# EAGLE design RainMeterRAK (EAGLE 9.6.2)
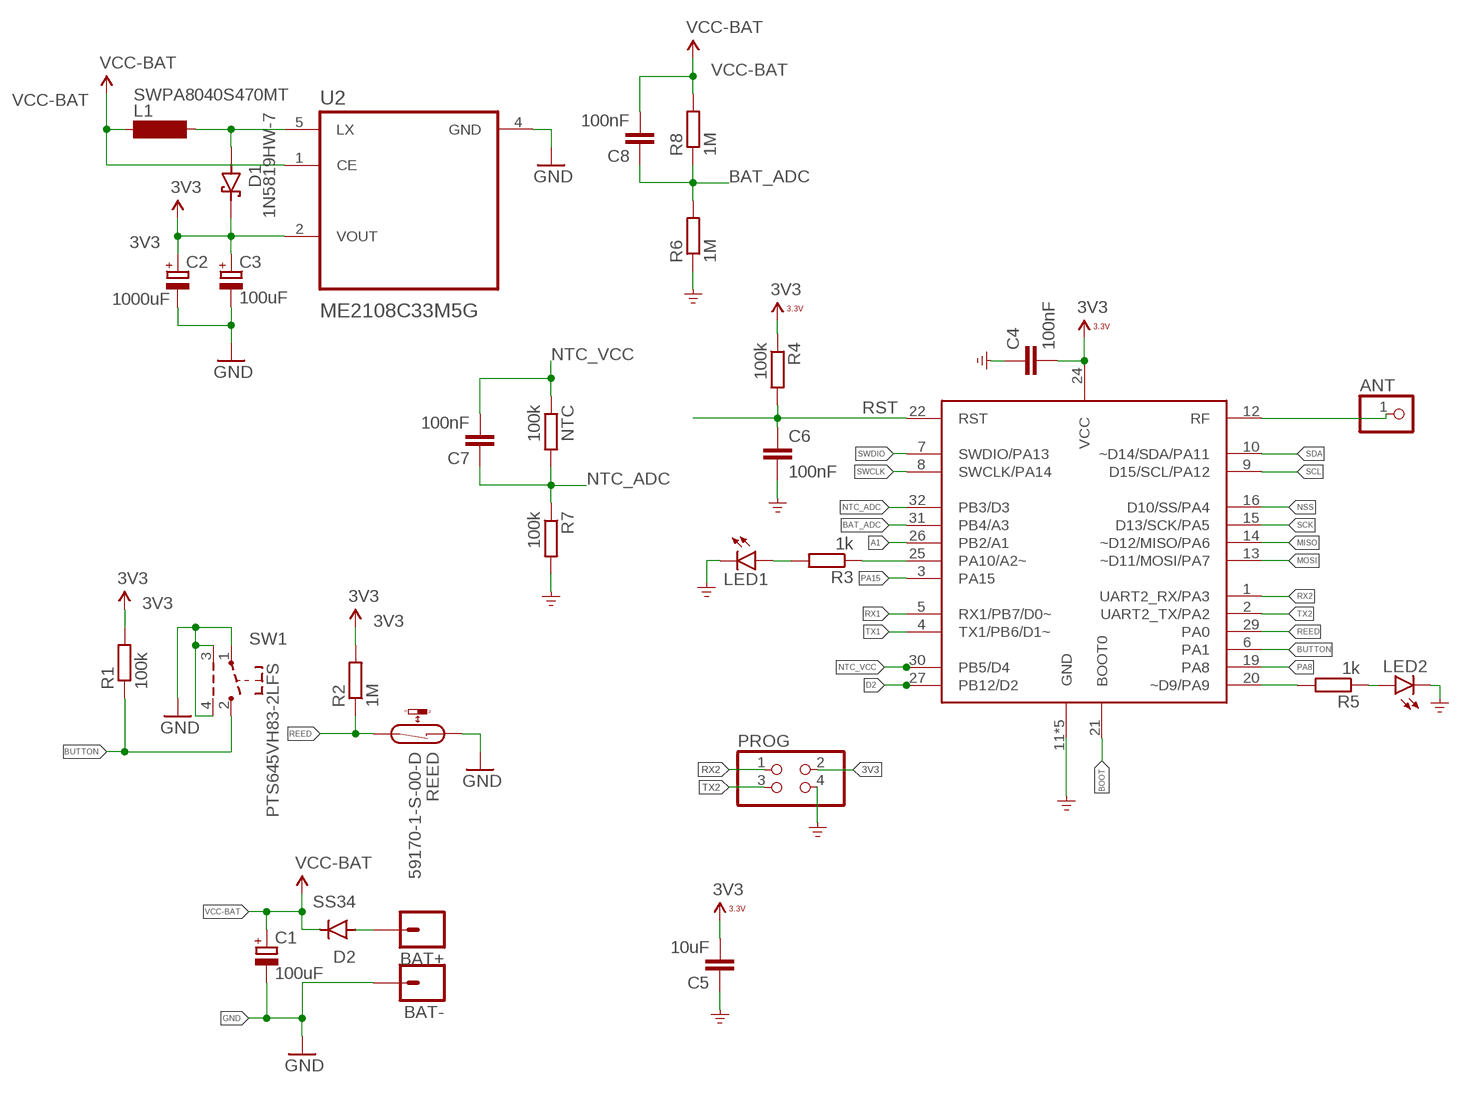
[diagram p0: schematic, sheet 1]

## Parts
ANT  PINHD-1X1  [1X01]
BAT+  M01OFFSET  [1X01_OFFSET]
BAT-  M01OFFSET  [1X01_OFFSET]
C1  100uF  CPOL-EUCT3528  [CT3528]
C2  1000uF  CPOL-EU140CLH-0810  [140CLH-0810]
C3  100uF  CPOL-EUCT3528  [CT3528]
C4  100nF  C-EUC0603  [C0603]
C5  10uF  C-EUC0603  [C0603]
C6  100nF  C-EUC0603  [C0603]
C7  100nF  C-EUC0603  [C0603]
C8  100nF  C-EUC0603  [C0603]
D1  1N5819HW-7  [SOD3715X145N]
D2  SS34  CGRM4001-G  [SOD-123_MINI-SMA]
L1  SWPA8040S470MT  SWPA8040S  [SWPA8040S]
LED1  LEDCHIP-LED0603  [CHIP-LED0603]
LED2  LEDCHIP-LED0603  [CHIP-LED0603]
NTC  100k  R-EU_R0603  [R0603]
PROG  PINHD-2X2  [2X02]
R1  100k  R-EU_R0603  [R0603]
R2  1M  R-EU_R0603  [R0603]
R3  1k  R-EU_R0603  [R0603]
R4  100k  R-EU_R0603  [R0603]
R5  1k  R-EU_R0603  [R0603]
R6  1M  R-EU_R0603  [R0603]
R7  100k  R-EU_R0603  [R0603]
R8  1M  R-EU_R0603  [R0603]
REED  59170-1-S-00-D  REED-SWITCH-CT10-1530-G1  [CT10-G1]
SW1  PTS645VH83-2LFS  SW_TACT_4P_B  [SW_TACT_STANDARD_RIGHT_ANGLE]
U1  RAK3172HF  [RAK3172]
U2  ME2108C33M5G  [SOT23-5]

## Nets
3V3: C2.+ C3.+ C4.2 C5.2 D1.C(K) PROG.2 R1.2 R2.2 R4.1 U1.24(VCC) U2.2(VOUT)
A1: U1.26(PB2/A1)
BAT_ADC: C8.1 R6.2 R8.1 U1.31(PB4/A3)
BOOT: U1.21(BOOT0)
BUTTON: R1.1 SW1.2 U1.6(PA1)
D2: U1.27(PB12/D2)
GND: BAT-.1 C1.- C2.- C3.- C4.1 C5.1 C6.2 LED1.C LED2.C PROG.4 R6.1 R7.2 REED.1 SW1.1 SW1.3 SW1.4 U1.11(GND) U1.17(GND) U1.18(GND) U1.23(GND) U1.28(GND) U2.4(GND) ; supply symbol labelled GND_POWER
MISO: U1.14(~D12/MISO/PA6)
MOSI: U1.13(~D11/MOSI/PA7)
N$1: D1.A L1.2 U2.5(LX)
N$2: R5.2 U1.20(~D9/PA9)
N$3: LED2.A R5.1
N$4: R3.1 U1.25(PA10/A2~)
N$5: LED1.A R3.2
N$6: ANT.1 U1.12(RF)
N$7: BAT+.1 D2.A
NSS: U1.16(D10/SS/PA4)
NTC_ADC: C7.1 NTC.2 R7.1 U1.32(PB3/D3)
NTC_VCC: C7.2 NTC.1 U1.30(PB5/D4)
PA8: U1.19(PA8)
PA15: U1.3(PA15)
REED: R2.1 REED.2 U1.29(PA0)
RST: C6.1 R4.2 U1.22(RST)
RX1: U1.5(RX1/PB7/D0~)
RX2: PROG.1 U1.1(UART2_RX/PA3)
SCK: U1.15(D13/SCK/PA5)
SCL: U1.9(D15/SCL/PA12)
SDA: U1.10(~D14/SDA/PA11)
SWCLK: U1.8(SWCLK/PA14)
SWDIO: U1.7(SWDIO/PA13)
TX1: U1.4(TX1/PB6/D1~)
TX2: PROG.3 U1.2(UART2_TX/PA2)
VCC-BAT: C1.+ C8.2 D2.C L1.1 R8.2 U2.1(CE)

## Library data of the parts
ANT = pinhead:PINHD-1X1: PIN HEADER
BAT+ BAT- = SparkFun-Connectors:M01: Header 1 Standard 1-pin 0.1" header. Use with straight break away headers (SKU : PRT-00116), right angle break away headers (PRT-00553), swiss pins (PRT-00743), machine pins (PRT-00117), and female headers (PRT-00115).
C1-C3 = rcl:CPOL-EU: POLARIZED CAPACITOR, European symbol; SPICEPREFIX: C
C4-C8 = rcl:C-EU: CAPACITOR, European symbol; SPICEPREFIX: C
D1 = 1N5819HW-7:1N5819HW-7: 1N5819HW Series 40 V 1 A Surface Mount Schottky Barrier Rectifier - SOD-123 Check availability <https://pricing.snapeda.com/parts/1N5819HW-7/Diodes%20Inc./view-part?ref=eda>; AVAILABILITY: In Stock; DESCRIPTION: Diode Schottky 40 V 1A Surface Mount SOD-123; MF: Diodes Inc.; MP: 1N5819HW-7; PACKAGE: SOD-123 Fairchild Semiconductor; PRICE: None; PURCHASE-URL: https://pricing.snapeda.com/search/part/1N5819HW-7/?ref=eda
D2 = diode:CGRM400*-G: Molded plasitc,JEDEC SOD-123/Mini SMA Source: Comchip CGRM4001-G.pdf
L1 = SWPA8040S:SWPA8040S
LED1 LED2 = led:LED: LED OSRAM: - CHIPLED LG R971, LG N971, LY N971, LG Q971, LY Q971, LO R971, LY R971 LH N974, LH R974 LS Q976, LO Q976, LY Q976 LO Q996 - Hyper CHIPLED LW Q18S LB Q993, LB Q99A, LB R99A - SideLED LS A670, LO A670, LY A670, LG A670, LP A670 LB A673, LV A673, LT A673, LW A673 LH A674 LY A675 LS A676, LA A676, LO A676, LY A676, LW A676 LS A679, LY A679, LG A679 - Hyper Micro SIDELED® LS Y876, LA Y876, LO Y876, LY Y876 LT Y87S - SmartLED LW L88C, LW L88S LB L89C, LB L89S, LG L890 LS L89K, LO L89K, LY L89K LS L896, LA L896, LO L896, LY L896 - TOPLED LS T670, LO T670, LY T670, LG T670, LP T670 LSG T670, LSP T670, LSY T670, LOP T670, LYG T670 LG T671, LOG T671, LSG T671 LB T673, LV T673, LT T673, LW T673 LH T674 LS T676, LA T676, LO T676, LY T676, LB T676, LH T676, LSB T676, LW T676 LB T67C, LV T67C, LT T67C, LS T67K, LO T67K, LY T67K, LW E67C LS E67B, LA E67B, LO E67B, LY E67B, LB E67C, LV E67C, LT E67C LW T67C LS T679, LY T679, LG T679 LS T770, LO T770, LY T770, LG T770, LP T770 LB T773, LV T773, LT T773, LW T773 LH T774 LS E675, LA E675, LY E675, LS T675 LS T776, LA T776, LO T776, LY T776, LB T776 LHGB T686 LT T68C, LB T68C - Hyper Mini TOPLED® LB M676 - Mini TOPLED Santana® LG M470 LS M47K, LO M47K, LY M47K Source: http://www.osram.convergy.de LUXEON: - LUMILED® LXK2-PW12-R00, LXK2-PW12-S00, LXK2-PW14-U00, LXK2-PW14-V00 LXK2-PM12-R00, LXK2-PM12-S00, LXK2-PM14-U00 LXK2-PE12-Q00, LXK2-PE12-R00, LXK2-PE12-S00, LXK2-PE14-T00, LXK2-PE14-U00 LXK2-PB12-K00, LXK2-PB12-L00, LXK2-PB12-M00, LXK2-PB14-N00, LXK2-PB14-P00, LXK2-PB14-Q00 LXK2-PR12-L00, LXK2-PR12-M00, LXK2-PR14-Q00, LXK2-PR14-R00 LXK2-PD12-Q00, LXK2-PD12-R00, LXK2-PD12-S00 LXK2-PH12-R00, LXK2-PH12-S00 LXK2-PL12-P00, LXK2-PL12-Q00, LXK2-PL12-R00 Source: www.luxeon.com KINGBRIGHT: KA-3528ASYC Source: www.kingbright.com
NTC R1-R8 = rcl:R-EU_: RESISTOR, European symbol; SPICEPREFIX: R
PROG = pinhead:PINHD-2X2: PIN HEADER
REED = switch-reed:REED-SWITCH-: Reed Sensor; MF: COTO TECHNOLOGY; MPN: CT10-1530-G1; OC_FARNELL: 1081696
SW1 = dp_devices:SW_TACT_4P_B
U1 = RAK3172:RAK3172: RAK4260 LoRaWAN module from RAKwireless.
U2 = ME2108C33M5G:ME2108C33M5G: Check availability <https://pricing.snapeda.com/parts/TLV62568DBVR/Texas%20Instruments/view-part?ref=eda>; AVAILABILITY: In Stock; DESCRIPTION: 2.5V-5.5V input, 1A high efficiency step-down buck converter in SOT23 and SOT563 package; MF: Texas Instruments; MP: TLV62568DBVR; PACKAGE: SOT-23-5 Texas Instruments; PRICE: None; PURCHASE-URL: https://pricing.snapeda.com/search/part/TLV62568DBVR/?ref=eda

## Board
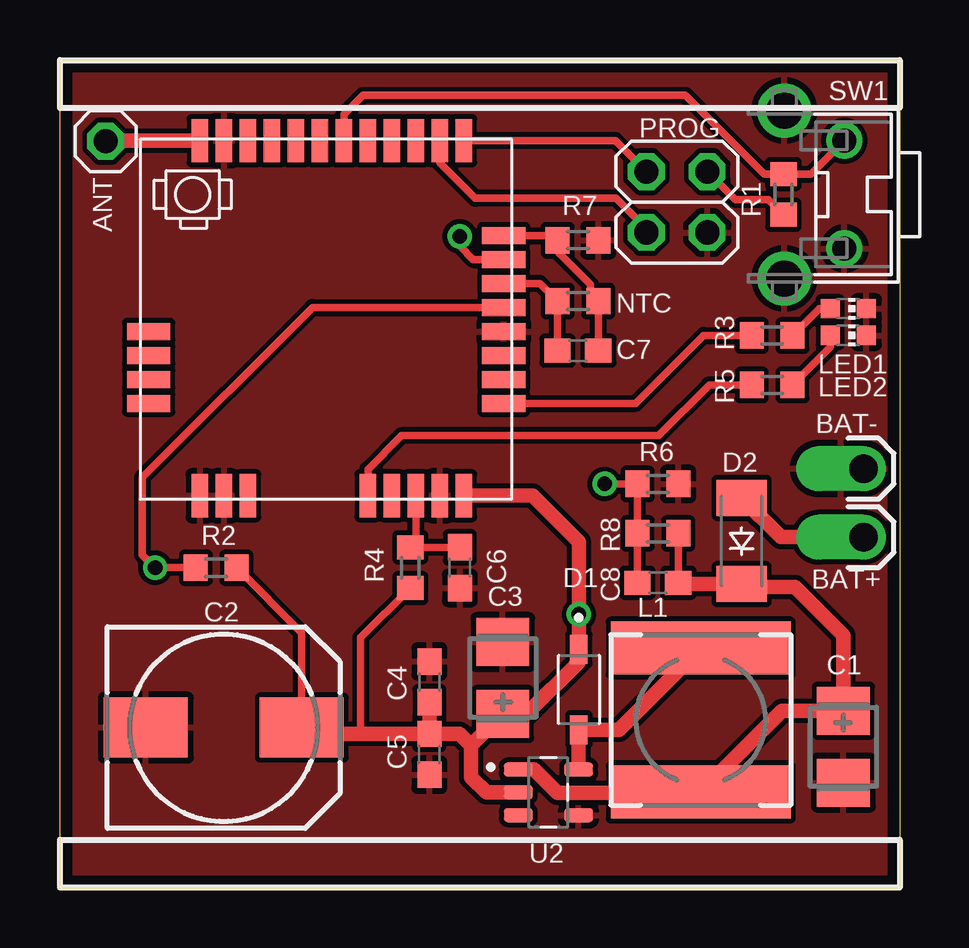
[diagram p1: board, top side]
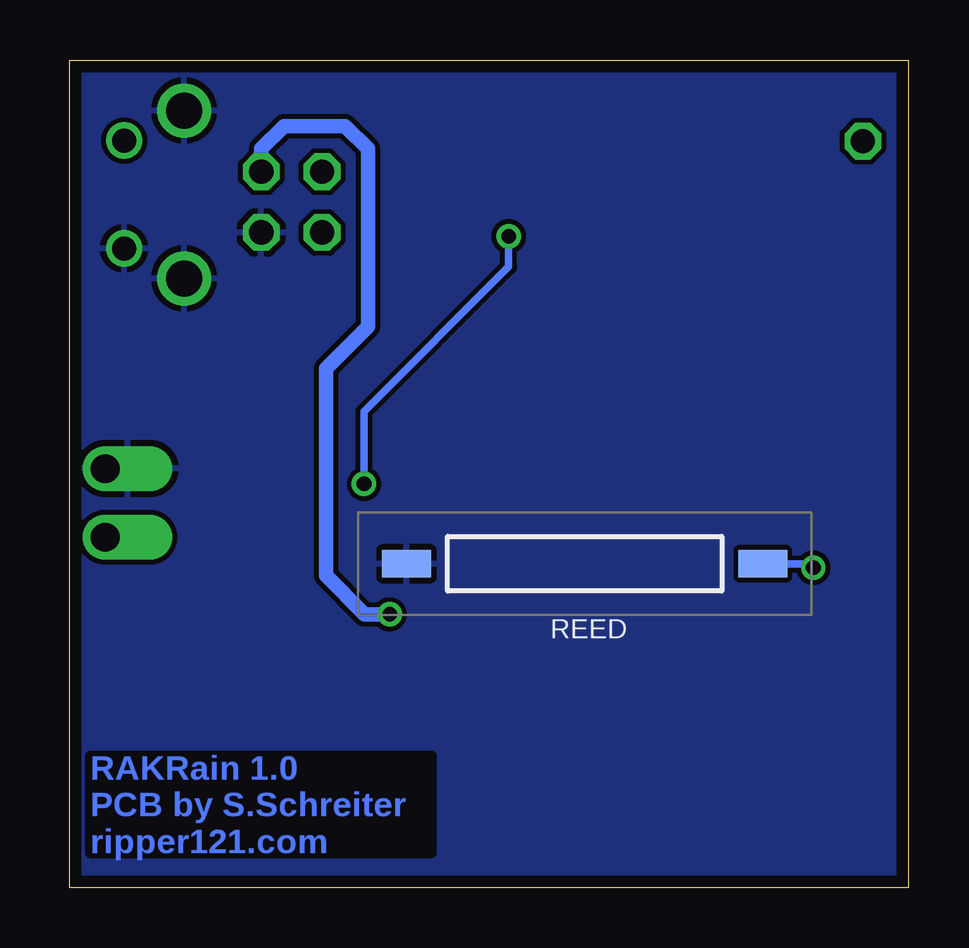
[diagram p2: board, bottom side, seen from below]

Size 35 x 34.5 mm. Coordinates in mm from the lower left corner, seen from the top.
Outline: 0,0 35,0 35,34.5 0,34.5 0,0
Copper layers (1*16): Top 0.035mm / dielectric 1.5mm / Bottom 0.035mm
Design rules "default *": minimum track width 10mil, minimum drill 24mil, track to track 8mil, track to pad 8mil, pad to pad 8mil, via to via 8mil, smd to smd 8mil, copper to edge 20mil, drill to drill 8mil, minimum pad ring 10mil, minimum via ring 8mil, stop-mask expansion 4mil, vias tented up to drill 0mil, thermal gap 10mil

### Footprints (pad centres in the part's own frame; a part is rotated, then mirrored left to right if it is on the bottom)
1X01 = drill 1.016 octagon: 1 0,0
1X01_OFFSET = drill 1.2 pad 1.88 offset: 1 0,0
CT3528 = smd 2 x 2.2: + -1.5,0; - 1.5,0
140CLH-0810 = smd 3.5 x 2.5: + 3.25,0; - -3.25,0
C0603 = smd 1.1 x 1: 1 -0.85,0; 2 0.85,0
SOD3715X145N = smd 1.21 x 0.73: A 1.68,0; C -1.68,0
SOD-123_MINI-SMA = smd 1.5 x 2.1: A 1.8,0; C -1.8,0
SWPA8040S = smd 2.2 x 7.5: 1 -3,0; 2 3,0
CHIP-LED0603 = smd 0.8 x 0.8: A 0,-0.75; C 0,0.75
R0603 = smd 1 x 1.1: 1 -0.85,0; 2 0.85,0
2X02 = drill 1.016 octagon: 1 -1.27,-1.27; 2 -1.27,1.27; 3 1.27,-1.27; 4 1.27,1.27
CT10-G1 = smd 2.03 x 1.14: 1 -7.425,0; 2 7.425,0
SW_TACT_STANDARD_RIGHT_ANGLE = drill 1: 1 -2.25,0; 2 2.25,0 | drill 1.5: 3 -3.5,2.5; 4 3.5,2.5
RAK3172 = smd 0.7 x 1.8: 1 13.5,14.945; 2 12.5,14.945; 3 11.5,14.945; 4 10.5,14.945; 5 9.5,14.945; 6 8.5,14.945; 7 7.5,14.945; 8 6.5,14.945; 9 5.5,14.945; 10 4.5,14.945; 11 3.5,14.945; 12 2.5,14.945; 17 2.5,0.145; 18 3.5,0.145; 19 4.5,0.145; 20 9.5,0.145; 21 10.5,0.145; 22 11.5,0.145; 23 12.5,0.145; 24 13.5,0.145 | smd 1.8 x 0.7: 13 0.365,6.99; 14 0.365,5.99; 15 0.365,4.99; 16 0.365,3.99; 25 15.165,3.99; 26 15.165,4.99; 27 15.165,5.99; 28 15.165,6.99; 29 15.165,7.99; 30 15.165,8.99; 31 15.165,9.99; 32 15.165,10.99
SOT23-5 = smd 1.21 x 0.59: 1 -1.255,0.95; 2 -1.255,0; 3 -1.255,-0.95; 4 1.255,-0.95; 5 1.255,0.95

### Placement (x,y rotation side)
ANT  1.91,31.11 0 top
BAT+  33.5,14.61 90 top
BAT-  33.5,17.46 90 top
C1  32.66,5.87 270 top
C2  6.83,6.67 0 top
C3  18.46,8.73 90 top
C4  15.4,8.57 270 top
C5  15.4,5.56 90 top
C6  16.67,13.34 270 top
C7  21.59,22.38 180 top
C8  24.92,12.7 0 top
D1  21.63,8.26 270 top
D2  28.42,14.45 90 top
L1  26.71,6.99 90 top
LED1  32.86,24.13 270 top
LED2  32.86,23.02 270 top
NTC  21.59,24.45 0 top
PROG  25.72,28.57 270 top
R1  30.16,28.89 270 top
R2  6.51,13.34 0 top
R3  29.69,23.02 0 top
R4  14.61,13.34 90 top
R5  29.69,20.95 180 top
R6  24.92,16.83 180 top
R7  21.59,26.99 0 top
R8  24.92,14.76 0 top
REED  13.5,13.5 0 bottom
SW1  32.7,28.89 90 top
U1  3.33,16.19 0 top
U2  20.36,3.97 0 top

### Tracks (layer width: path | path; a pad name or v marks a point on that pad's centre or on a via)
3V3  (via drill 0.61)
  Top 0.305: C2.+ 10.08,10.62 R2.2 | R1.2 29.53,28.68 28.16,28.68 PROG.2 | R4.1 12.54,10.42 12.54,6.41
  Top 0.61: U2.2 17.78,3.97 17.14,4.6 17.14,5.92 | 17.14,5.92 C3.+ 19.45,7.23 21.63,9.41 D1.C v21.63,11.39 21.63,14.4 19.7,16.34 U1.24 | C5.2 16.66,6.41 17.14,5.92 | C4.2 C5.2 | C2.+ 10.34,6.41 12.54,6.41 C5.2
  Bottom 0.61: v21.63,11.39 22.67,11.39 24.29,13.01 24.29,21.64 22.54,23.39 22.54,30.8 23.5,31.75 26.04,31.75 26.99,30.8 PROG.2
BAT_ADC  (via drill 0.61)
  Top 0.305: C8.1 R8.1 R6.2 v22.7,16.83 | v16.67,27.15 16.67,26.74 17.23,26.18 U1.31
  Bottom 0.305: v16.67,27.15 16.67,25.88 22.7,19.84 v22.7,16.83
BUTTON
  Top 0.305: SW1.2 31.3,29.74 R1.1 29.37,29.74 26.08,33.03 12.63,33.03 11.83,32.23 U1.6
GND
  pour Bottom: -0.32,0.05 35.16,0.05 35.16,34.48 -0.32,34.49
  pour Top: -0.32,0.05 35.16,0.05 35.16,34.48 -0.32,34.48
N$1
  Top 0.61: L1.2 23.3,6.58 D1.A 21.62,6.56 U2.5
N$2
  Top 0.305: R5.2 27.07,20.95 24.96,18.84 14.24,18.84 12.83,17.44 U1.20
N$3
  Top 0.305: R5.1 32.11,22.53 LED2.A
N$4
  Top 0.305: U1.25 23.99,20.18 26.83,23.02 R3.1
N$5
  Top 0.305: R3.2 31.65,24.13 LED1.A
N$6
  Top 0.61: U1.12 1.93,31.14 ANT.1
N$7
  Top 0.61: BAT+.1 30.06,14.61 D2.A
NTC_ADC
  Top 0.305: U1.32 20.55,27.18 R7.1 20.74,26.51 22.12,25.13 22.12,24.77 NTC.2 C7.1
NTC_VCC
  Top 0.305: U1.30 20,25.18 NTC.1 C7.2
REED  (via drill 0.61)
  Top 0.305: U1.29 10.53,24.18 3.44,17.09 3.44,13.87 v3.97,13.34 R2.1
  Bottom 0.305: REED.2 4.13,13.5 v3.97,13.34
RST
  Top 0.305: C6.1 R4.2 14.83,14.41 U1.22
RX2
  Top 0.305: PROG.1 23.16,31.14 U1.1
TX2
  Top 0.305: PROG.3 24.45,27.46 23.18,28.73 17.3,28.73 15.83,30.2 U1.2
VCC-BAT
  Top 0.305: C8.2 R8.2
  Top 0.61: U2.1 19.77,4.92 20.74,3.95 26.67,3.95 L1.1 30.1,7.37 C1.+ 32.66,10.52 30.64,12.54 28.52,12.54 D2.C 25.83,12.65 C8.2

### Text on the board
Bottom: RAKRain 1.0 / PCB by S.Schreiter / ripper121.com
bStop: RAKRain 1.0 / PCB by S.Schreiter / ripper121.com